# EAGLE design debug (EAGLE 9.6.2)

## Sheet 1 of 2
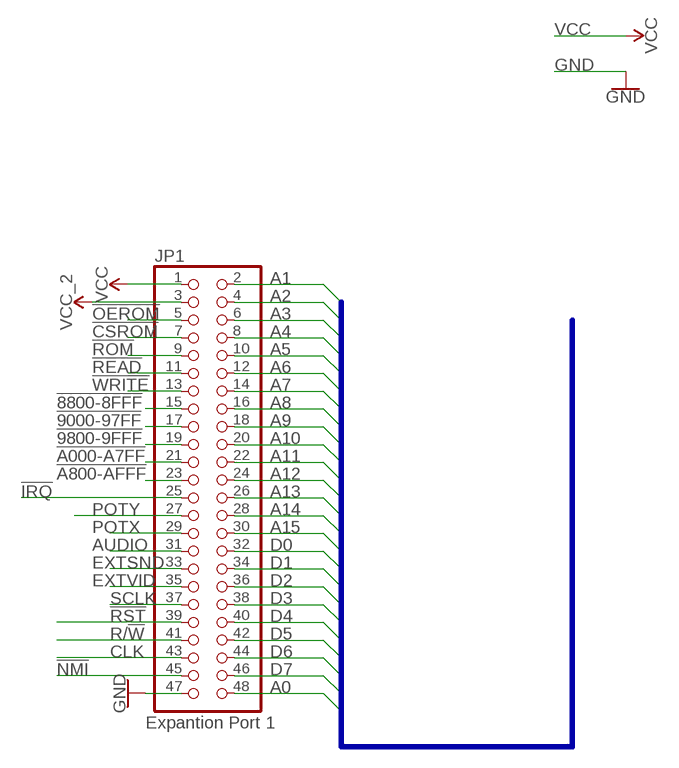
[diagram p0: schematic, sheet 1]

### Parts
JP1  PINHD-2X24/90  [2X24/90]

### Nets
!8800-8FFF: JP1.15
!9000-97FF: JP1.17
!9800-9FFF: JP1.19
!A000-A7FF: JP1.21
!A800-AFFF: JP1.23
!CSROM: JP1.7
!IRQ: JP1.25 ; also sheet 2
!NMI: JP1.45 ; also sheet 2
!OEROM: JP1.5
!READ: JP1.11
!ROM: JP1.9
!RST: JP1.39
!WRITE: JP1.13
A0: JP1.48 ; also sheet 2
A1: JP1.2 ; also sheet 2
A2: JP1.4 ; also sheet 2
A3: JP1.6 ; also sheet 2
A4: JP1.8 ; also sheet 2
A5: JP1.10 ; also sheet 2
A6: JP1.12 ; also sheet 2
A7: JP1.14 ; also sheet 2
A8: JP1.16 ; also sheet 2
A9: JP1.18 ; also sheet 2
A10: JP1.20 ; also sheet 2
A11: JP1.22 ; also sheet 2
A12: JP1.24 ; also sheet 2
A13: JP1.26 ; also sheet 2
A14: JP1.28 ; also sheet 2
A15: JP1.30 ; also sheet 2
AUDIO: JP1.31
CLK: JP1.43 ; also sheet 2
D0: JP1.32 ; also sheet 2
D1: JP1.34 ; also sheet 2
D2: JP1.36 ; also sheet 2
D3: JP1.38 ; also sheet 2
D4: JP1.40 ; also sheet 2
D5: JP1.42 ; also sheet 2
D6: JP1.44 ; also sheet 2
D7: JP1.46 ; also sheet 2
EXTSND: JP1.33
EXTVID: JP1.35
GND: JP1.47 ; also sheet 2
POTX: JP1.29
POTY: JP1.27
R/!W: JP1.41 ; also sheet 2
SCLK: JP1.37
VCC: JP1.1 ; also sheet 2
VCC_2: JP1.3

### Buses
BUS:A[0..15],D[0..7]

### Notes on the sheet
- Expantion Port 1

## Sheet 2 of 2
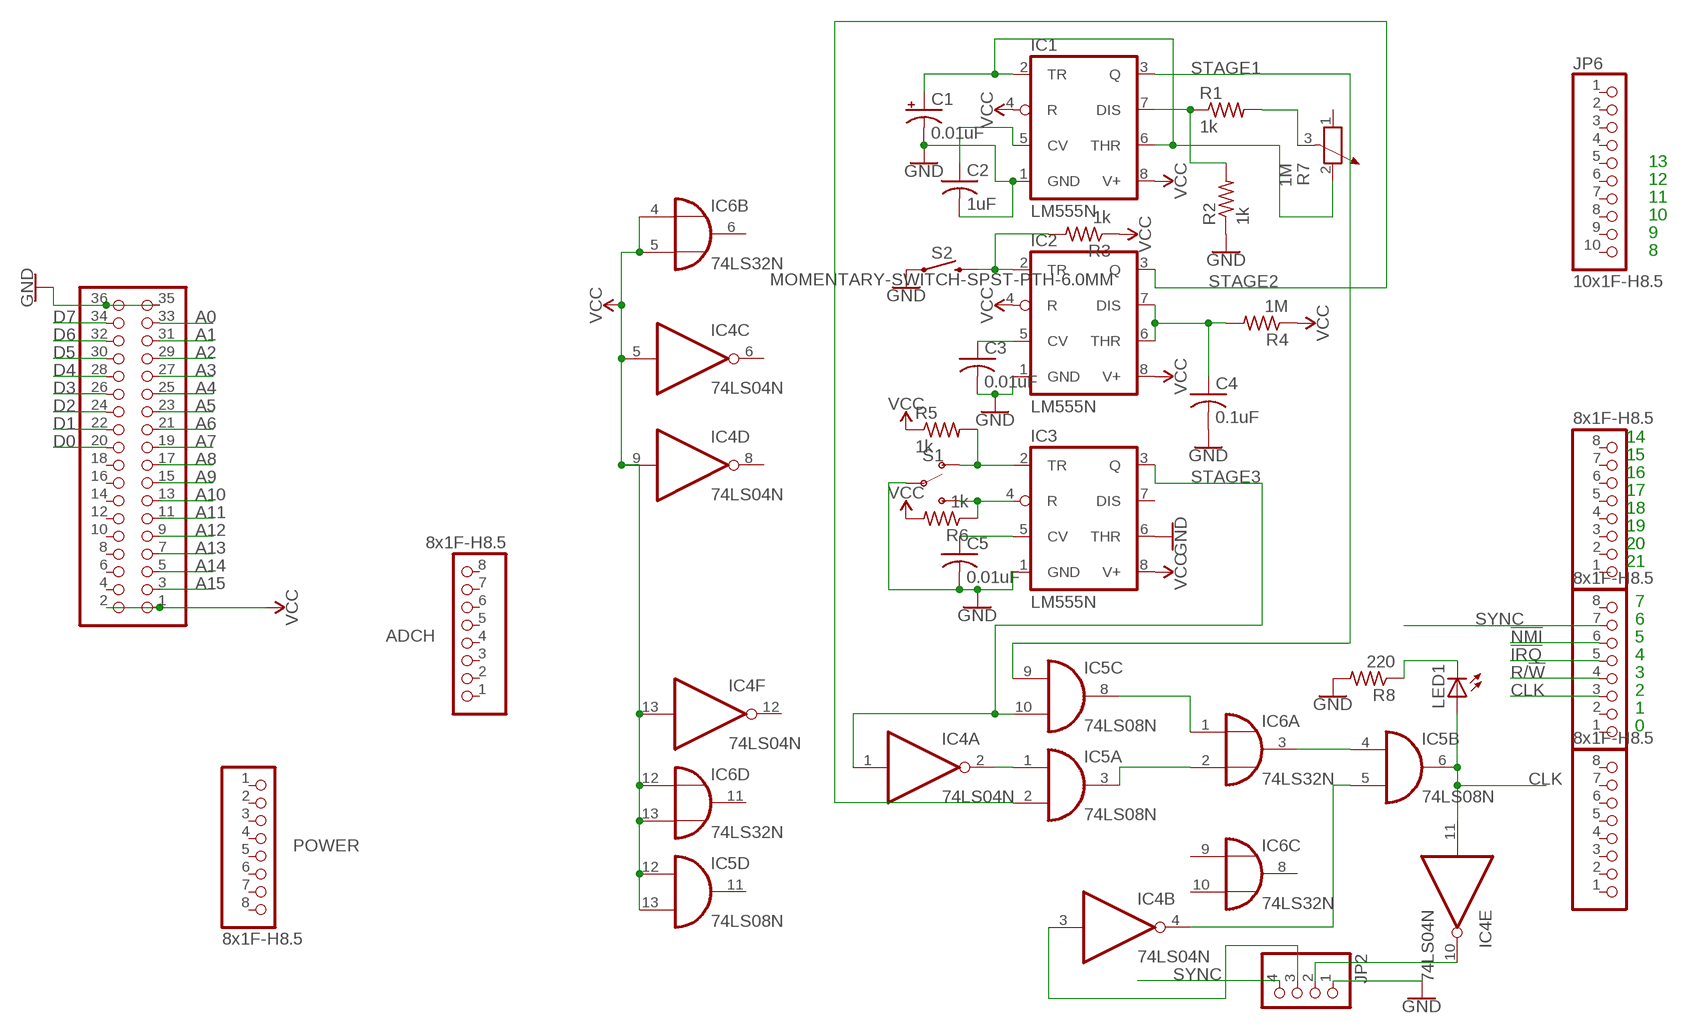
[diagram p1: schematic, sheet 2]

### Parts
ADCH  8x1F-H8.5  PINHD-1X8  [1X08]
ADCL  8x1F-H8.5  PINHD-1X8  [1X08]
C1  0.01uF  CPOL-USE5-10.5  [E5-10,5]
C2  1uF  C-US025-030X050  [C025-030X050]
C3  0.01uF  C-US025-030X050  [C025-030X050]
C4  0.1uF  C-US025-030X050  [C025-030X050]
C5  0.01uF  C-US025-030X050  [C025-030X050]
COMMUNICATION  8x1F-H8.5  PINHD-1X8  [1X08]
IC1  LM555N  [DIL08-ROUND]
IC2  LM555N  [DIL08-ROUND]
IC3  LM555N  [DIL08-ROUND]
IC4  74LS04N  [DIL14]
IC5  74LS08N  [DIL14]
IC6  74LS32N  [DIL14]
JP2  PINHD-1X4  [1X04]
JP6  10x1F-H8.5  PINHD-1X10_ARD  [1X10]
LED1  LED5MM  [LED5MM]
POWER  8x1F-H8.5  PINHD-1X8  [1X08]
PWML  8x1F-H8.5  PINHD-1X8  [1X08]
R1  1k  R-US_0204/7  [0204/7]
R2  1k  R-US_0204/7  [0204/7]
R3  1k  R-US_0204/7  [0204/7]
R4  1M  R-US_0204/7  [0204/7]
R5  1k  R-US_0204/7  [0204/7]
R6  1k  R-US_0204/7  [0204/7]
R7  1M  POTENTIOMETER_PT-10  [PT-10]
R8  220  R-US_0204/7  [0204/7]
S1  SWITCH-SPDT-PTH-11.6X4.0MM-LOCK  [SWITCH_SPDT_PTH_11.6X4.0MM_LOCK]
S2  MOMENTARY-SWITCH-SPST-PTH-6.0MM  [TACTILE_SWITCH_PTH_6.0MM]
XIO  18x2F-H8.5  PINHD-2X18  [2X18]

### Nets
!IRQ: PWML.5 ; also sheet 1
!NMI: PWML.6 ; also sheet 1
A0: XIO.33 ; also sheet 1
A1: XIO.31 ; also sheet 1
A2: XIO.29 ; also sheet 1
A3: XIO.27 ; also sheet 1
A4: XIO.25 ; also sheet 1
A5: XIO.23 ; also sheet 1
A6: XIO.21 ; also sheet 1
A7: XIO.19 ; also sheet 1
A8: XIO.17 ; also sheet 1
A9: XIO.15 ; also sheet 1
A10: XIO.13 ; also sheet 1
A11: XIO.11 ; also sheet 1
A12: XIO.9 ; also sheet 1
A13: XIO.7 ; also sheet 1
A14: XIO.5 ; also sheet 1
A15: XIO.3 ; also sheet 1
CLK: IC4.11(E:I) IC5.6(B:O) LED1.A PWML.3 ; also sheet 1
D0: XIO.20 ; also sheet 1
D1: XIO.22 ; also sheet 1
D2: XIO.24 ; also sheet 1
D3: XIO.26 ; also sheet 1
D4: XIO.28 ; also sheet 1
D5: XIO.30 ; also sheet 1
D6: XIO.32 ; also sheet 1
D7: XIO.34 ; also sheet 1
GND: C1.- C2.2 C3.2 C4.2 C5.2 IC1.1(GND) IC2.1(GND) IC3.1(GND) IC3.6(THR) JP2.1 R2.1 R8.2 S1.2(P) S2.1 XIO.35 XIO.36 ; also sheet 1
N$1: C1.+ IC1.2(TR) IC1.6(THR) R7.2
N$2: C2.1 IC1.5(CV)
N$3: IC2.2(TR) R3.2 S2.3
N$4: IC1.7(DIS) R1.1 R2.2
N$5: R1.2 R7.3
N$6: C4.1 IC2.6(THR) IC2.7(DIS) R4.2
N$7: C3.1 IC2.5(CV)
N$8: C5.1 IC3.5(CV)
N$9: IC3.2(TR) R5.2 S1.1(O)
N$10: IC3.4(R) R6.1 S1.3(S)
N$11: IC4.2(A:O) IC5.1(A:I0)
N$12: IC5.8(C:O) IC6.1(A:I0)
N$13: IC5.3(A:O) IC6.2(A:I1)
N$14: IC5.4(B:I0) IC6.3(A:O)
N$15: IC4.4(B:O) IC5.5(B:I1)
N$16: IC4.3(B:I) JP2.3
N$17: IC4.10(E:O) JP2.2
N$18: LED1.K(C) R8.1
R/!W: PWML.4 ; also sheet 1
STAGE1: IC1.3(Q) IC5.9(C:I0)
STAGE2: IC2.3(Q) IC5.2(A:I1)
STAGE3: IC3.3(Q) IC4.1(A:I) IC5.10(C:I1)
SYNC: JP2.4 PWML.7
VCC: IC1.4(R) IC1.8(V+) IC2.4(R) IC2.8(V+) IC3.8(V+) IC4.5(C:I) IC4.9(D:I) IC4.13(F:I) IC5.12(D:I0) IC5.13(D:I1) IC6.4(B:I0) IC6.5(B:I1) IC6.12(D:I0) IC6.13(D:I1) R3.1 R4.1 R5.1 R6.2 XIO.1 XIO.2 ; also sheet 1
Unconnected: ADCH.1 ADCH.2 ADCH.3 ADCH.4 ADCH.5 ADCH.6 ADCH.7 ADCH.8 ADCL.1 ADCL.2 ADCL.3 ADCL.4 ADCL.5 ADCL.6 ADCL.7 ADCL.8 COMMUNICATION.1 COMMUNICATION.2 COMMUNICATION.3 COMMUNICATION.4 COMMUNICATION.5 COMMUNICATION.6 COMMUNICATION.7 COMMUNICATION.8 IC3.7(DIS) IC4.6(C:O) IC4.8(D:O) IC4.12(F:O) IC5.11(D:O) IC6.6(B:O) IC6.8(C:O) IC6.9(C:I0) IC6.10(C:I1) IC6.11(D:O) JP6.1 JP6.2 JP6.3 JP6.4 JP6.5 JP6.6 JP6.7 JP6.8 JP6.9 JP6.10 POWER.1 POWER.2 POWER.3 POWER.4 POWER.5 POWER.6 POWER.7 POWER.8 PWML.1 PWML.2 PWML.8 R7.1 XIO.4 XIO.6 XIO.8 XIO.10 XIO.12 XIO.14 XIO.16 XIO.18

### Notes on the sheet
- 13
- 12
- 11
- 10
- 9
- 8
- 14
- 15
- 16
- 17
- 18
- 19
- 20
- 21
- 7
- 6
- 5
- 4
- 3
- 2
- 1
- 0

## Power pins joined to a net without a drawn wire
GND: IC4.7(P:GND) IC5.7(P:GND) IC6.7(P:GND)
VCC: IC4.14(P:VCC) IC5.14(P:VCC) IC6.14(P:VCC)

## Library data of the parts
ADCH ADCL COMMUNICATION POWER PWML = SmartPrj:PINHD-1X8: PIN HEADER
C1 = adafruit:CPOL-US: POLARIZED CAPACITOR, American symbol
C2-C5 = adafruit:C-US: CAPACITOR, American symbol
IC1-IC3 = adafruit:*555: TIMER Changed DIP package to have round (not oval) pin pads http://www.ladyada.net/library/pcb/eaglelibrary.html
IC4 = 74xx-eu:74*04: Hex INVERTER
IC5 = 74xx-eu:74*08: Quad 2-input AND gate
IC6 = 74xx-eu:74*32: Quad 2-input OR gate
JP1 = pinhead:PINHD-2X24: PIN HEADER
JP2 = pinhead:PINHD-1X4: PIN HEADER
JP6 = SmartPrj:PINHD-1X10_ARD: PIN HEADER
LED1 = adafruit:LED: LED OSRAM: - CHIPLED LG R971, LG N971, LY N971, LG Q971, LY Q971, LO R971, LY R971 LH N974, LH R974 LS Q976, LO Q976, LY Q976 LO Q996 - Hyper CHIPLED LW Q18S LB Q993, LB Q99A, LB R99A - SideLED LS A670, LO A670, LY A670, LG A670, LP A670 LB A673, LV A673, LT A673, LW A673 LH A674 LY A675 LS A676, LA A676, LO A676, LY A676, LW A676 LS A679, LY A679, LG A679 - Hyper Micro SIDELED® LS Y876, LA Y876, LO Y876, LY Y876 LT Y87S - SmartLED LW L88C, LW L88S LB L89C, LB L89S, LG L890 LS L89K, LO L89K, LY L89K LS L896, LA L896, LO L896, LY L896 - TOPLED LS T670, LO T670, LY T670, LG T670, LP T670 LSG T670, LSP T670, LSY T670, LOP T670, LYG T670 LG T671, LOG T671, LSG T671 LB T673, LV T673, LT T673, LW T673 LH T674 LS T676, LA T676, LO T676, LY T676, LB T676, LH T676, LSB T676, LW T676 LB T67C, LV T67C, LT T67C, LS T67K, LO T67K, LY T67K, LW E67C LS E67B, LA E67B, LO E67B, LY E67B, LB E67C, LV E67C, LT E67C LW T67C LS T679, LY T679, LG T679 LS T770, LO T770, LY T770, LG T770, LP T770 LB T773, LV T773, LT T773, LW T773 LH T774 LS E675, LA E675, LY E675, LS T675 LS T776, LA T776, LO T776, LY T776, LB T776 LHGB T686 LT T68C, LB T68C - Hyper Mini TOPLED® LB M676 - Mini TOPLED Santana® LG M470 LS M47K, LO M47K, LY M47K Source: http://www.osram.convergy.de/
R1-R6 R8 = adafruit:R-US_: RESISTOR, American symbol
R7 = rcl:POTENTIOMETER_: Potentiometer; SPICEMODEL: POT; SPICEPREFIX: X
S1 = SparkFun-Switches:SWITCH-SPDT: Single Pole, Double Throw (SPDT) Switch Single-pole, double-throw (SPDT) switch. Variant Overview SMD-AYZ0202 Surface Mount DPDT Switch <https://www.sparkfun.com/products/597> (COM-00597) Used on e.g. LilyPad Arduino USB - ATmega32U4 Board <https://www.sparkfun.com/products/12049> PTH-11.6X4.0MM SPDT Mini Power Switch <https://www.sparkfun.com/products/102> (COM-00102) Used on e.g. SparkFun Simon Says - Through-Hole Soldering Kit <https://www.sparkfun.com/products/10547> (KIT-10547) PTH-11.6X4.0MM-KIT KIT version of SPDT Mini Power Switch - Simplifies soldering by removing tStop of switch pins - only one side can be soldered. PTH-11.6X4.0MM-LOCK LOCK version of SPDT Mini Power Switch - Offset pins hold switch in place for easier soldering. SMD-RIGHT-ANGLE Surface Mount Right Angle Switch <https://www.sparkfun.com/products/10860> (COM-10860) Used on e.g. SparkFun ESP8266 Thing <https://www.sparkfun.com/products/13231>; PROD_ID: SWCH-08261; SF_SKU: COM-00102
S2 = SparkFun-Switches:MOMENTARY-SWITCH-SPST: Momentary Switch (Pushbutton) - SPST Normally-open (NO) SPST momentary switches (buttons, pushbuttons). Variants PTH-12MM - 12mm square, through-hole Momentary Pushbutton Switch - 12mm Square <https://www.sparkfun.com/products/9190> (COM-09190) PTH-6.0MM, PTH-6.0MM-KIT - 6.0mm square, through-hole Mini Pushbutton Switch <https://www.sparkfun.com/products/97> (COM-00097) KIT package intended for soldering kit's - only one side of pads' copper is exposed. PTH-RIGHT-ANGLE-KIT - Right-angle, through-hole Right Angle Tactile Button <https://www.sparkfun.com/products/10791> - Used on SparkFun BigTime Watch Kit <https://www.sparkfun.com/products/11734> SMD-12MM - 12mm square, surface-mount Tactile Button - SMD (12mm) <https://www.sparkfun.com/products/12993> (COM-12993) Used on SparkFun PicoBoard <https://www.sparkfun.com/products/11888> SMD-4.5MM - 4.5mm Square Trackball Switch Used on SparkFun Blackberry Trackballer Breakout <https://www.sparkfun.com/products/13169> SMD-4.6MMX2.8MM - 4.60mm x 2.80mm, surface mount Used on SparkFun SAMD21 Mini Breakout <https://www.sparkfun.com/products/13664> SMD-5.2MM, SMD-5.2-REDUNDANT - 5.2mm square, surface-mount Mini Pushbutton Switch - SMD <https://www.sparkfun.com/products/8720> (COM-08720) Used on Arduino Pro Mini <https://www.sparkfun.com/products/11114> REDUNDANT package connects both switch circuits together SMD-6.0X3.5MM - 6.0 x 3.5mm, surface mount Momentary Reset Switch SMD <https://www.sparkfun.com/products/8229> (COM-08229) SMD-6.2MM-TALL - 6.2mm square, surface mount Tactile Button - SMD (6mm) <https://www.sparkfun.com/products/12992> Used on SparkFun Digital Sandbox <https://www.sparkfun.com/products/12651> SMD-RIGHT-ANGLE - Right-angle, surface mount Used on SparkFun Block for Intel® Edison - Arduino <https://www.sparkfun.com/products/13036>; PROD_ID: SWCH-08441; SF_SKU: COM-00097
XIO = SmartPrj:PINHD-2X18: PIN HEADER

## Net classes
1 power: width 0.61 mm, drill 0.406 mm, clearance 0.203 mm
2 gnd: width 0.305 mm, drill 0.406 mm, clearance 0.203 mm
3 power usb: width 0.508 mm, drill 0.406 mm, clearance 0.203 mm

## Board
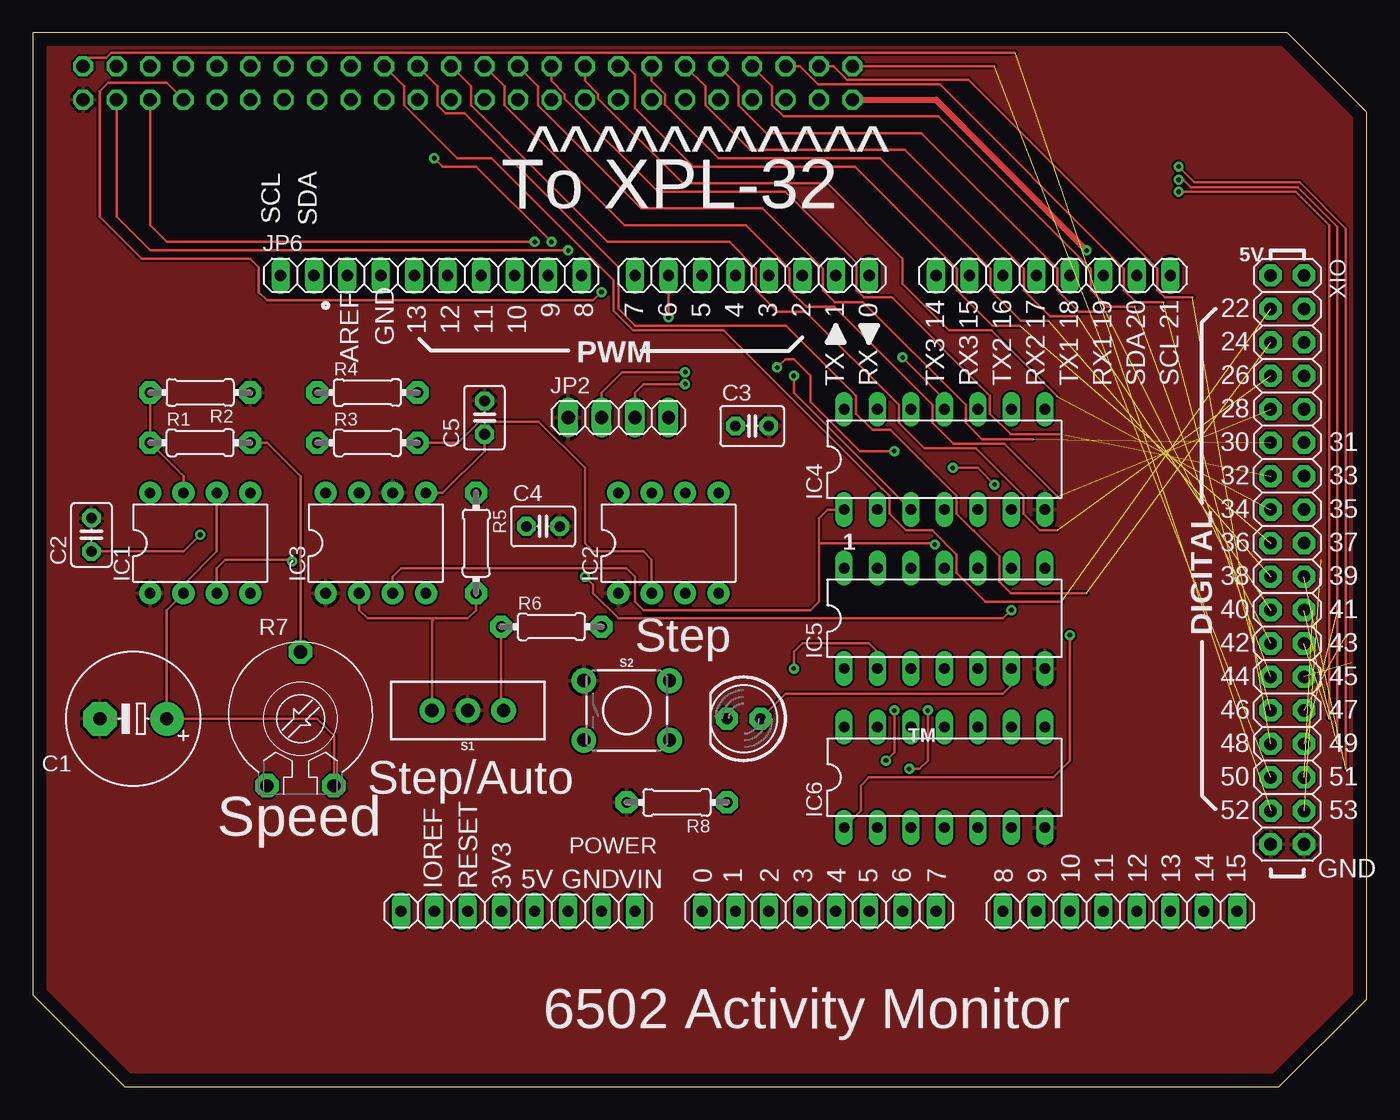
[diagram p2: board, top side]
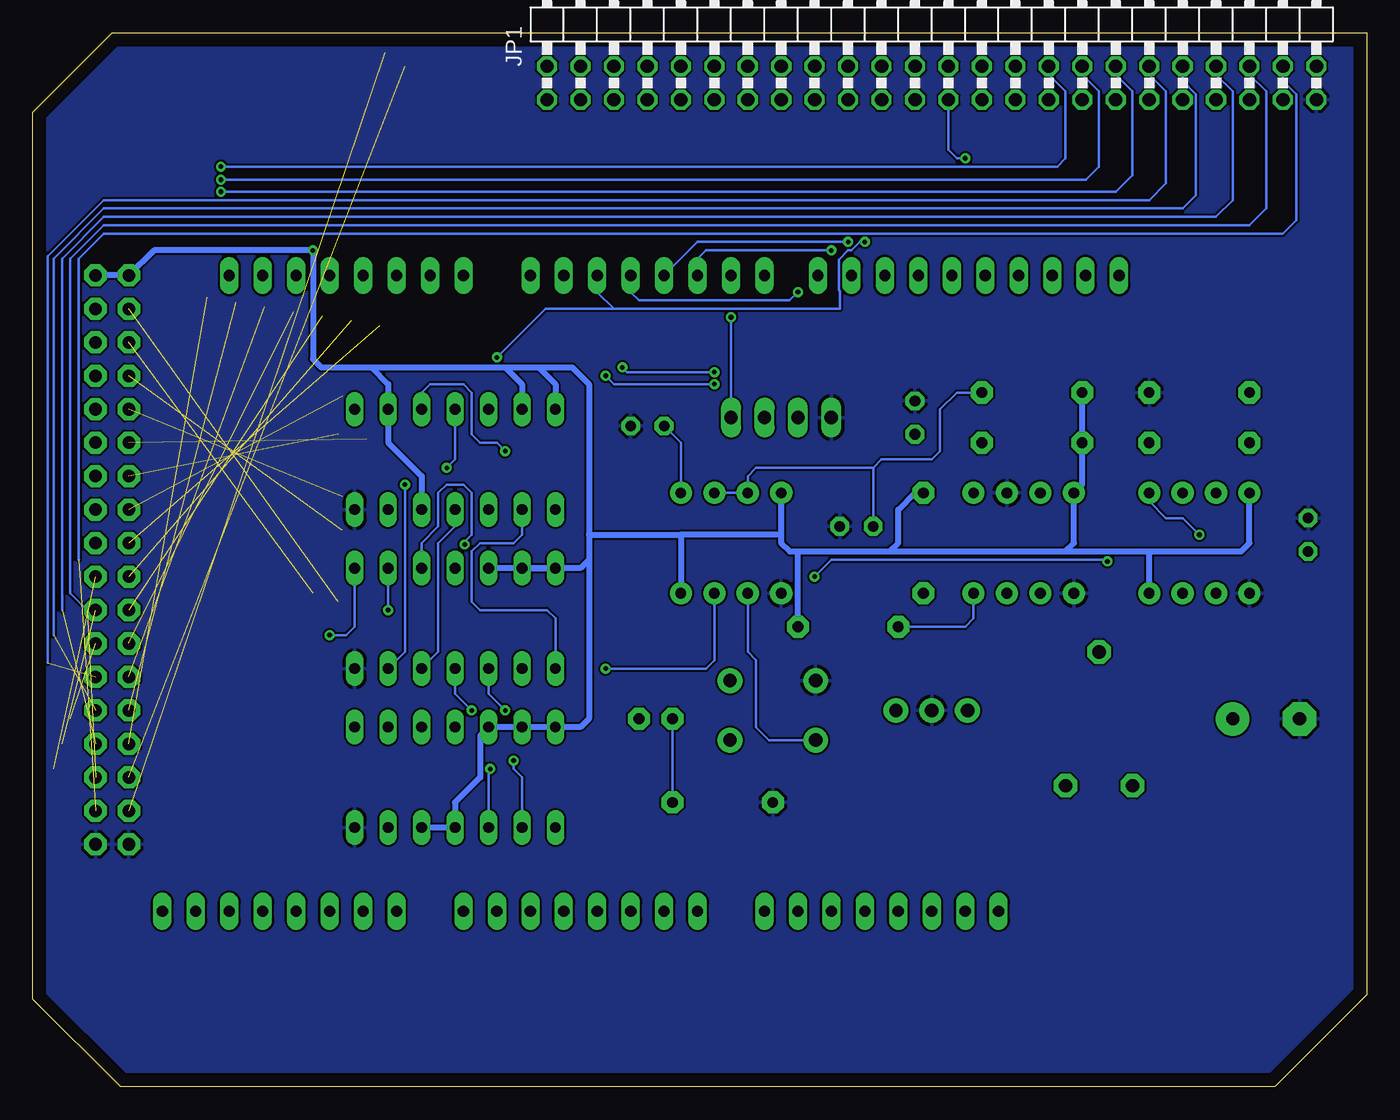
[diagram p3: board, bottom side, seen from below]

Size 101.27 x 80 mm. Coordinates in mm from the lower left corner, seen from the top.
Outline: 0,80 0,6.99 6.98,0 94.61,0 101.27,6.66 101.27,73.99 95.26,80 0,80
Copper layers (1*16): Top 0.035mm / dielectric 1.5mm / Bottom 0.035mm
Design rules "default": minimum track width 6mil, minimum drill 0.35mm, track to track 6mil, track to pad 6mil, pad to pad 6mil, via to via 6mil, smd to smd 6mil, copper to edge 40mil, drill to drill 6mil, minimum pad ring 10mil, minimum via ring 8mil, stop-mask expansion 4mil, vias tented up to drill 0mil, thermal gap 10mil
Holes 3.2 mm at 83.82,-57.15 2.54,-8.89 77.47,-8.89 1.27,-57.15 53.34,-24.13 53.34,-52.07

### Footprints (pad centres in the part's own frame; a part is rotated, then mirrored left to right if it is on the bottom)
1X08 = drill 0.85 pad 1.422 long: 1 -8.89,0; 2 -6.35,0; 3 -3.81,0; 4 -1.27,0; 5 1.27,0; 6 3.81,0; 7 6.35,0; 8 8.89,0
E5-10,5 = drill 1.016 pad 2.54: + -2.54,0 | drill 1.016 pad 2.54 octagon: - 2.54,0
C025-030X050 = drill 0.813 pad 1.422 octagon: 1 -1.27,0; 2 1.27,0
DIL08-ROUND = drill 0.813 pad 1.676: 1 -3.81,-3.81; 2 -1.27,-3.81; 3 1.27,-3.81; 4 3.81,-3.81; 5 3.81,3.81; 6 1.27,3.81; 7 -1.27,3.81; 8 -3.81,3.81
DIL14 = drill 0.813 long: 1 -7.62,-3.81; 2 -5.08,-3.81; 3 -2.54,-3.81; 4 0,-3.81; 5 2.54,-3.81; 6 5.08,-3.81; 7 7.62,-3.81; 8 7.62,3.81; 9 5.08,3.81; 10 2.54,3.81; 11 0,3.81; 12 -2.54,3.81; 13 -5.08,3.81; 14 -7.62,3.81
2X24/90 = drill 1.016 octagon: 1 -29.21,-6.35; 2 -29.21,-3.81; 3 -26.67,-6.35; 4 -26.67,-3.81; 5 -24.13,-6.35; 6 -24.13,-3.81; 7 -21.59,-6.35; 8 -21.59,-3.81; 9 -19.05,-6.35; 10 -19.05,-3.81; 11 -16.51,-6.35; 12 -16.51,-3.81; 13 -13.97,-6.35; 14 -13.97,-3.81; 15 -11.43,-6.35; 16 -11.43,-3.81; 17 -8.89,-6.35; 18 -8.89,-3.81; 19 -6.35,-6.35; 20 -6.35,-3.81; 21 -3.81,-6.35; 22 -3.81,-3.81; 23 -1.27,-6.35; 24 -1.27,-3.81; 25 1.27,-6.35; 26 1.27,-3.81; 27 3.81,-6.35; 28 3.81,-3.81; 29 6.35,-6.35; 30 6.35,-3.81; 31 8.89,-6.35; 32 8.89,-3.81; 33 11.43,-6.35; 34 11.43,-3.81; 35 13.97,-6.35; 36 13.97,-3.81; 37 16.51,-6.35; 38 16.51,-3.81; 39 19.05,-6.35; 40 19.05,-3.81; 41 21.59,-6.35; 42 21.59,-3.81; 43 24.13,-6.35; 44 24.13,-3.81; 45 26.67,-6.35; 46 26.67,-3.81; 47 29.21,-6.35; 48 29.21,-3.81
1X04 = drill 1.016 long: 1 -3.81,0; 2 -1.27,0; 3 1.27,0; 4 3.81,0
1X10 = drill 0.85 pad 1.422 long: 1 -11.43,0; 2 -8.89,0; 3 -6.35,0; 4 -3.81,0; 5 -1.27,0; 6 1.27,0; 7 3.81,0; 8 6.35,0; 9 8.89,0; 10 11.43,0
LED5MM = drill 0.813 pad 1.676 octagon: A -1.27,0; K 1.27,0
0204/7 = drill 0.813 pad 1.676 octagon: 1 -3.81,0; 2 3.81,0
PT-10 = drill 1.016 pad 1.778 octagon: 1 -2.54,-5.08; 2 2.54,-5.08; 3 0,5.08
SWITCH_SPDT_PTH_11.6X4.0MM_LOCK = drill 1.016 pad 1.88: 1 0,2.718; 2 0,0; 3 0,-2.718
TACTILE_SWITCH_PTH_6.0MM = drill 1.016 pad 1.88: 1 -3.251,2.261; 2 3.251,2.261; 3 -3.251,-2.261; 4 3.251,-2.261
2X18 = drill 0.95 pad 1.676 octagon: 1 -21.59,-1.27; 2 -21.59,1.27; 3 -19.05,-1.27; 4 -19.05,1.27; 5 -16.51,-1.27; 6 -16.51,1.27; 7 -13.97,-1.27; 8 -13.97,1.27; 9 -11.43,-1.27; 10 -11.43,1.27; 11 -8.89,-1.27; 12 -8.89,1.27; 13 -6.35,-1.27; 14 -6.35,1.27; 15 -3.81,-1.27; 16 -3.81,1.27; 17 -1.27,-1.27; 18 -1.27,1.27; 19 1.27,-1.27; 20 1.27,1.27; 21 3.81,-1.27; 22 3.81,1.27; 23 6.35,-1.27; 24 6.35,1.27; 25 8.89,-1.27; 26 8.89,1.27; 27 11.43,-1.27; 28 11.43,1.27; 29 13.97,-1.27; 30 13.97,1.27; 31 16.51,-1.27; 32 16.51,1.27; 33 19.05,-1.27; 34 19.05,1.27; 35 21.59,-1.27; 36 21.59,1.27

### Placement (x,y rotation side)
ADCH  82.55,13.34 0 top
ADCL  59.69,13.34 0 top
C1  7.62,27.94 180 top
C2  4.45,41.91 90 top
C3  54.61,50.16 0 top
C4  38.74,42.55 0 top
C5  34.29,50.8 90 top
COMMUNICATION  77.47,61.59 180 top
IC1  12.7,41.27 0 top
IC2  48.26,41.27 0 top
IC3  26.04,41.27 0 top
IC4  69.21,47.62 0 top
IC5  69.21,35.56 0 top
IC6  69.21,23.5 0 top
JP1  33.02,81.28 0 bottom
JP2  44.45,50.8 0 top
JP6  30.23,61.59 0 top
LED1  53.98,27.94 180 top
POWER  36.83,13.34 0 top
PWML  54.61,61.59 180 top
R1  12.7,48.9 0 top
R2  12.7,52.7 180 top
R3  25.4,48.9 0 top
R4  25.4,52.7 0 top
R5  33.66,41.27 270 top
R6  39.37,34.92 0 top
R7  20.32,27.94 0 top
R8  48.9,21.59 180 top
S1  33.02,28.57 90 top
S2  45.09,28.57 0 top
XIO  95.25,40.01 270 top

### Tracks (layer width: path | path; a pad name or v marks a point on that pad's centre or on a via)
!IRQ  (via drill 0.35)
  Top 0.203: v39.37,64.14 33.66,69.85 31.11,69.85 v30.48,70.48
  Bottom 0.203: PWML.5 50.8,64.14 v39.37,64.14 | v30.48,70.48 31.11,70.48 31.75,71.12 JP1.25
!NMI  (via drill 0.35)
  Top 0.203: JP1.45 6.35,66.04 8.89,63.5 v40.64,63.5
  Bottom 0.203: v40.64,63.5 50.17,63.5 50.8,62.87 PWML.6
A0  (1 unrouted)
  Top 0.203: 74.55,78.49 5.93,78.49 5.55,78.11 3.81,78.11 JP1.48
A1  (1 unrouted)
  Top 0.203: 73.02,77.47 JP1.2
A2  (1 unrouted)
  Top 0.203: JP1.4 60.79,77.47 61.81,76.45 71.04,76.45 85.39,62.1 85.39,60.48 85.96,59.92 88.04,59.92
A3  (1 unrouted)
  Top 0.203: JP1.6 58.25,77.47 59.62,76.1 68.85,76.1 82.85,62.1 82.85,60.48 83.78,59.56 85.85,59.56
A4  (1 unrouted)
  Top 0.203: 83.67,59.21 81.59,59.21 80.31,60.48 80.31,62.1 68.75,73.66 56.98,73.66 56.13,74.51 56.13,75.95 JP1.8
A5  (1 unrouted)
  Top 0.203: 81.48,58.85 79.41,58.85 77.77,60.48 77.77,62.1 67.48,72.39 55.71,72.39 53.59,74.51 53.59,75.95 JP1.10
A6  (1 unrouted)
  Top 0.203: 79.3,58.5 77.22,58.5 75.23,60.48 75.23,62.1 66.21,71.12 54.44,71.12 51.05,74.51 51.05,75.95 JP1.12
A7  (1 unrouted)
  Top 0.203: 77.11,58.14 75.04,58.14 72.69,60.48 72.69,62.1 64.31,70.48 52.07,70.48 48.01,74.55 48.01,75.35 46.99,76.37 JP1.14
A8  (1 unrouted)
  Top 0.203: 74.93,57.78 72.85,57.78 70.16,60.48 70.16,62.1 62.4,69.85 50.17,69.85 45.72,74.3 45.72,76.83 44.45,78.11 JP1.16
A9  (1 unrouted)
  Top 0.203: 77.75,52.43 77.75,52.47 72.79,57.43 69.57,57.43 66.04,60.96 66.04,62.87 60.33,68.58 49.36,68.58 42.93,75.02 42.93,75.35 41.91,76.37 JP1.18
A10  (1 unrouted)
  Top 0.203: JP1.20 39.37,76.37 40.39,75.35 40.39,75.02 47.46,67.94 57.15,67.94 62.54,62.56 62.54,60.48 63.1,59.92 65.22,59.92 72.67,52.47 72.67,51.11 74.25,49.53 78.1,49.53
A11  (1 unrouted)
  Top 0.203: 75.92,49.17 72.06,49.17 70.84,50.4 70.84,51.76 63.04,59.56 60.92,59.56 60,60.48 60,62.1 55.42,66.67 46.19,66.67 38.35,74.51 38.35,75.95 JP1.22
A12  (1 unrouted)
  Top 0.203: 77.75,44.81 77.75,44.85 73.78,48.82 69.88,48.82 68.3,50.4 68.3,51.76 60.86,59.21 58.73,59.21 57.46,60.48 57.46,62.1 54.15,65.41 44.92,65.41 35.81,74.51 35.81,75.95 JP1.24
A13  (1 unrouted)
  Top 0.203: 77.77,42.24 76.46,42.24 75.21,43.49 75.21,44.85 71.6,48.46 67.69,48.46 65.76,50.4 65.76,51.76 58.67,58.85 56.55,58.85 54.92,60.48 54.92,62.1 52.88,64.14 43.65,64.14 33.27,74.51 33.27,75.95 JP1.26
A14  (1 unrouted)
  Top 0.203: 80.01,37.47 74.25,37.47 73.38,38.33 73.38,40.28 71.42,42.24 71.38,42.24 70.13,43.49 70.13,44.85 65.12,49.86 63.76,49.86 62.51,51.11 62.51,52.47 57.2,57.78 45.72,57.78 44.45,59.05 44.45,62.23 32.77,73.91 31.33,73.91 30.73,74.51 30.73,75.95 JP1.28
A15  (1 unrouted)
  Top 0.203: JP1.30 28.19,75.95 28.19,74.51 32.22,70.48 34.84,70.48 44.09,61.23 44.09,58.91 45.57,57.43 52.43,57.43 64.47,45.39 64.51,45.39 65.05,44.85 65.05,43.49 66.3,42.24 68.3,42.24 70.13,40.41 70.13,39.04 72.34,36.83 78.1,36.83
CLK  (via drill 0.35)
  Top 0.203: JP1.43 8.89,65.41 10.16,64.14 v38.1,64.14 | IC5.6 74.3,30.48 73.66,29.84 57.15,29.84 LED1.A | v73.02,45.72 71.75,46.99 v69.85,46.99 | v66.04,55.37 69.21,52.19 IC4.11
  Bottom 0.203: v38.1,64.14 38.48,64.14 39.11,63.5 39.37,63.5 40.08,62.79 40.08,60.48 40.01,60.41 40.01,59.05 57.15,59.05 | 57.15,59.05 58.42,60.33 PWML.3 | IC5.6 73.02,33.02 v73.02,45.72 | v69.85,46.99 69.21,47.62 IC4.11 | v66.04,55.37 62.35,59.05 57.15,59.05
D0  (via drill 0.35)  (1 unrouted)
  Top 0.203: v86.99,69.85 88.19,68.66 96.18,68.66 99.69,65.14 99.69,24.13
  Bottom 0.203: v86.99,69.85 23.5,69.85 22.86,70.48 22.86,75.56 24.13,76.83 JP1.32
D1  (via drill 0.35)  (1 unrouted)
  Top 0.203: v86.99,68.85 87.36,68.85 87.91,68.3 96.03,68.3 99.06,65.27 99.06,26.04
  Bottom 0.203: v86.99,68.85 21.32,68.85 20.32,69.85 20.32,75.56 21.59,76.83 JP1.34
D2  (via drill 0.35)  (1 unrouted)
  Top 0.203: 98.42,27.94 98.42,65.41 95.88,67.94 v86.99,67.94
  Bottom 0.203: v86.99,67.94 19.05,67.94 17.78,69.22 17.78,75.56 19.05,76.83 JP1.36
D3  (1 unrouted)
  Bottom 0.203: 100.15,32.21 100.15,63.04 95.88,67.31 16.51,67.31 15.24,68.58 15.24,75.56 16.51,76.83 JP1.38
D4  (1 unrouted)
  Bottom 0.203: JP1.40 13.97,76.37 12.95,75.35 12.95,67.69 13.97,66.67 95.88,66.67 99.69,62.87 99.69,34.29
D5  (1 unrouted)
  Bottom 0.203: 99.06,36.2 99.06,62.87 95.88,66.04 11.43,66.04 10.16,67.31 10.16,75.56 11.43,76.83 JP1.42
D6  (1 unrouted)
  Bottom 0.203: JP1.44 8.89,76.83 7.62,75.56 7.62,66.67 8.89,65.41 95.88,65.41 98.42,62.87 98.42,37.47 97.16,36.2
D7  (1 unrouted)
  Bottom 0.203: JP1.46 6.35,76.37 5.33,75.35 5.33,65.79 6.35,64.77 95.88,64.77 97.79,62.87 97.79,40.01
GND
  pour Top: -3.18,80.01 -3.18,0 104.77,0 104.77,80.01
  pour Bottom: -1.9,80.01 -1.9,0 102.87,0 102.87,80.01
N$1
  Top 0.203: IC1.6 13.97,40.64 11.43,38.1 IC1.2 10.16,36.2 C1.+ 21.59,27.94 22.86,26.67 R7.2
N$2  (via drill 0.35)
  Top 0.203: v12.7,41.91 11.43,40.64 C2.1
  Bottom 0.203: v12.7,41.91 13.97,43.18 15.24,43.18 16.51,44.45 IC1.5
N$3
  Top 0.203: R3.2 32.29,48.9 33.89,50.49 38.41,50.49 41.91,46.99 41.91,41.27 42.55,40.64 46.36,40.64 46.99,40.01 IC2.2
  Bottom 0.203: S2.3 45.36,26.31 46.36,27.3 46.36,32.38 46.99,33.02 IC2.2
N$4
  Top 0.203: R2.2 R1.1 11.43,46.35 IC1.7
N$5
  Top 0.203: R1.2 17.78,48.9 20.32,46.35 R7.3
N$6
  Bottom 0.203: R4.2 31.11,52.7 32.38,51.44 32.38,48.26 33.02,47.62 36.83,47.62 37.47,46.99 | 37.47,46.99 C4.1 | 37.47,46.99 46.36,46.99 46.99,46.35 IC2.7 IC2.6
N$7
  Bottom 0.203: C3.1 52.07,48.9 IC2.5
N$8
  Top 0.203: IC3.5 31.11,45.09 34.29,48.26 C5.1
N$9
  Top 0.203: IC3.2 24.77,36.2 25.4,35.56 30.48,35.56 | 30.48,35.56 33.02,35.56 33.66,36.2 R5.2 | S1.1 30.3,35.38 30.48,35.56
N$10
  Top 0.203: S1.3 35.56,28.75 R6.1
  Bottom 0.203: IC3.4 29.84,35.56 30.48,34.92 R6.1
N$11
  Bottom 0.203: IC5.1 61.6,35.56 62.23,36.2 67.31,36.2 67.94,36.83 67.94,40.64 67.31,41.27 64.77,41.27 64.14,41.91 IC4.2
N$12  (via drill 0.35)
  Top 0.203: IC6.1 62.87,20.95 62.87,22.86 63.5,23.5 77.47,23.5 78.74,24.77 v78.74,34.29
  Bottom 0.203: v78.74,34.29 77.47,34.29 76.83,34.92 IC5.8
N$13  (via drill 0.35)
  Top 0.203: v65.41,28.57 65.41,25.4 v64.77,24.77
  Bottom 0.203: IC5.3 66.67,29.84 v65.41,28.57 | v64.77,24.77 64.77,24.13 64.14,23.5 IC6.2
N$14  (via drill 0.35)
  Top 0.203: v67.94,28.57 67.94,24.77 67.31,24.13 v66.55,24.13
  Bottom 0.203: IC5.4 69.21,29.84 v67.94,28.57 | v66.55,24.13 66.67,24.01 IC6.3
N$15
  Bottom 0.203: IC5.5 70.48,33.02 70.48,41.27 69.21,42.55 IC4.4
N$16  (via drill 0.35)
  Top 0.203: IC4.3 57.79,52.7 v57.79,53.98 | v49.53,53.34 46.36,53.34 45.72,52.7 JP2.3
  Bottom 0.203: v57.79,53.98 57.15,53.34 v49.53,53.34
N$17  (via drill 0.35)
  Top 0.203: JP2.2 43.18,52.7 44.72,54.25 v49.53,54.25 | v56.52,54.61 57.15,55.24 57.79,55.24 59.05,53.98 59.05,52.02 62.82,48.26 v65.41,48.26
  Bottom 0.203: v49.53,54.25 56.15,54.25 v56.52,54.61 | v65.41,48.26 66.04,48.9 67.31,48.9 67.94,49.53 67.94,52.7 68.58,53.34 71.12,53.34 71.75,52.7 IC4.10
N$18
  Bottom 0.203: R8.1 LED1.K
R/!W  (via drill 0.35)
  Top 0.203: JP1.41 10.16,76.2 5.71,76.2 5.08,75.56 5.08,66.04 8.26,62.87 16.51,62.87 17.14,62.23 17.14,60.33 17.78,59.69 42.55,59.69 v43.18,60.33
  Bottom 0.203: v43.18,60.33 43.82,59.69 55.25,59.69 55.88,60.33 PWML.4
STAGE1  (via drill 0.35)
  Top 0.203: IC1.3 13.97,39.37 14.61,40.01 19.56,40.01 v19.68,39.88 | v41.91,38.73 42.55,38.1 42.55,37.47 44.45,35.56 73.66,35.56 v74.3,36.2
  Bottom 0.203: v19.68,39.88 19.81,40.01 40.64,40.01 v41.91,38.73 | v74.3,36.2 IC5.9
STAGE2  (via drill 0.35)
  Top 0.203: v57.79,31.75 57.79,33.02 58.42,33.66 63.5,33.66 64.14,33.02 IC5.2
  Bottom 0.203: v57.79,31.75 50.17,31.75 49.53,32.38 IC2.3
STAGE3  (via drill 0.35)
  Top 0.203: IC3.3 27.3,38.73 27.94,39.37 45.09,39.37 45.72,38.73 45.72,36.83 46.36,36.2 59.05,36.2 59.69,36.83 59.69,41.27 | IC4.1 60.33,43.81 59.69,43.18 59.69,41.27 | 59.69,41.27 68.37,41.27 v68.47,41.17
  Bottom 0.203: v68.47,41.17 68.47,41.38 67.94,41.91 67.94,45.09 68.58,45.72 69.85,45.72 70.48,45.09 70.48,42.55 71.75,41.27 IC5.10
SYNC  (via drill 0.35)
  Top 0.203: PWML.7 v48.26,58.42
  Bottom 0.203: v48.26,58.42 JP2.4
VCC  (via drill 0.35)
  Top 0.457: JP1.1 68.58,74.93 v80.01,63.5
  Bottom 0.457: 75.56,54.61 79.38,54.61 80.01,55.24 v80.01,63.5 92.08,63.5 XIO.1 XIO.2 | 75.56,54.61 74.3,53.34 IC4.9 74.3,48.9 71.75,46.35 IC4.5 | 75.56,54.61 65.41,54.61 | 65.41,54.61 64.14,53.34 IC4.13 | 65.41,54.61 62.87,54.61 | 62.87,54.61 61.6,53.34 IC4.14 | 62.87,54.61 60.33,54.61 59.05,53.34 59.05,41.91 | 59.05,41.91 59.05,40.01 | 59.05,40.01 59.69,39.37 IC5.14 | IC5.14 IC5.12 IC5.13 IC5.14 | 59.05,40.01 59.05,27.94 59.69,27.3 IC6.13 | IC6.13 IC6.12 67.31,26.67 67.31,23.5 69.21,21.59 IC6.4 IC6.5 | 59.05,41.91 52.07,41.91 | IC2.8 44.45,41.91 | 44.45,41.91 44.45,41.27 43.82,40.64 43.18,40.64 | 43.18,40.64 36.2,40.64 | 36.2,40.64 35.56,41.27 35.56,43.81 34.29,45.09 R5.1 | 52.07,41.91 IC2.4 | R6.2 43.18,40.64 | 36.2,40.64 22.86,40.64 | 22.86,40.64 22.22,41.27 IC3.8 21.59,45.72 R4.1 R3.1 | 22.86,40.64 16.51,40.64 | 16.51,40.64 9.53,40.64 8.89,41.27 IC1.8 | 44.45,41.91 52.07,41.91 | IC1.4 16.51,40.64 | IC6.14 IC6.13

### Text on the board
tPlace: 9 | 8 | 7 | 6 | 5 | 4 | 3 | 2 | 1 | 0 | 14 | 15 | 16 | 17 | 18 | 19 | 20 | 21 | 22 | 13 | 12 | 11 | 10 | 24 | 26 | 28 | 30 | 31 | 32 | 33 | 34 | 35 | 36 | 37 | 38 | 39 | 40 | 41 | 42 | 43 | 44 | 45 | 46 | 47 | TM | 48 | 49 | 50 | 51 | 52 | 53 | 0 | 1 | 2 | 3 | 4 | 5 | 6 | 7 | 8 | 9 | 10 | 11 | 12 | 13 | 14 | 15
tNames: ^^^^^^^^^^^ | To XPL-32 | SCL | SDA | 5V | GND | AREF | PWM | TX | RX | TX3 | RX3 | TX2 | RX2 | TX1 | RX1 | SDA | SCL | 1 | DIGITAL | Step | Step/Auto | Speed | GND | IOREF | RESET | 3V3 | 5V | GND | VIN | 6502 Activity Monitor